# Altium schematic sheet I2S.SchDoc
size A4
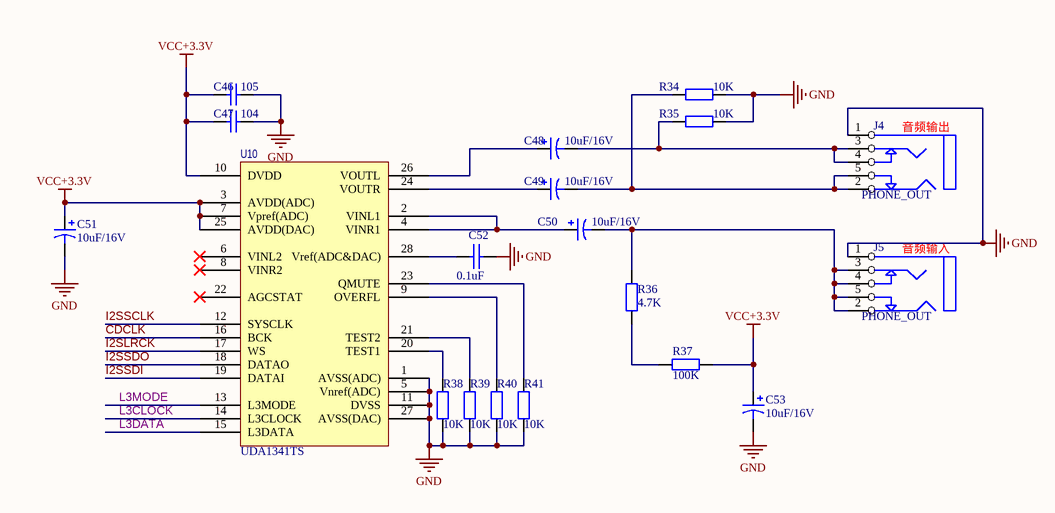
[diagram p0: I2S.SchDoc]

## Parts
C46  value 105  [0805]  (hidden comment: Cap)
C47  value 104  [0805]  (hidden comment: Cap)
C48  value 10uF/16V  [1206[3216]]  (hidden comment: Cap Pol2)
C49  value 10uF/16V  [1206[3216]]  (hidden comment: Cap Pol2)
C50  value 10uF/16V  [1206[3216]]  (hidden comment: Cap Pol2)
C51  value 10uF/16V  [1206[3216]]  (hidden comment: Cap Pol2)
C52  0.1uF  [0805]
C53  value 10uF/16V  [1206[3216]]  (hidden comment: Cap Pol2)
J4  PHONE_OUT  [PJ-215-B]
J5  PHONE_OUT  [PJ-215-B]
R34  value 10K  [0805]  (hidden comment: Res2)
R35  value 10K  [0805]  (hidden comment: Res2)
R36  value 4.7K  [0805]  (hidden comment: Res2)
R37  value 100K  [0805]  (hidden comment: Res2)
R38  value 10K  [0805]  (hidden comment: Res2)
R39  value 10K  [0805]  (hidden comment: Res2)
R40  value 10K  [0805]  (hidden comment: Res2)
R41  value 10K  [0805]  (hidden comment: Res2)
U10  UDA1341TS  [SOP_UDA1341TS_1]

## Nets
GND: C46.1 C47.1 C51.2 C52.2 C53.2 J4.1(A) J5.1(A) R34.2 R35.2 R38.1 R39.1 R40.1 R41.1 U10.1(AVSS(ADC)) U10.5(Vnref(ADC)) U10.11(DVSS) U10.27(AVSS(DAC))
VCC+3.3V: C46.2 C47.2 C51.1 C53.1 R37.1 U10.3(AVDD(ADC)) U10.7(Vpref(ADC)) U10.10(DVDD) U10.25(AVDD(DAC))
CDCLK: U10.16(BCK)
I2SLRCK: U10.17(WS)
I2SSCLK: U10.12(SYSCLK)
I2SSDI: U10.19(DATAI)
I2SSDO: U10.18(DATAO)
L3CLOCK: U10.14(L3CLOCK)
L3DATA: U10.15(L3DATA)
L3MODE: U10.13(L3MODE)
NetC48_1: C48.1 U10.26(VOUTL)
NetC48_2: C48.2 J4.3(C) J4.4(E) R35.1
NetC49_1: C49.1 U10.24(VOUTR)
NetC49_2: C49.2 J4.2(B) J4.5(F) R34.1
NetC50_1: C50.1 U10.2(VINL1) U10.4(VINR1)
NetC50_2: C50.2 J5.2(B) J5.3(C) J5.4(E) J5.5(F) R36.2
NetC52_1: C52.1 U10.28(Vref(ADC&DAC))
NetR36_1: R36.1 R37.2
NetR38_2: R38.2 U10.20(TEST1)
NetR39_2: R39.2 U10.21(TEST2)
NetR40_2: R40.2 U10.9(OVERFL)
NetR41_2: R41.2 U10.23(QMUTE)

Not connected (* = marked no-connect by the designer): U10 6(VINL2)* 8(VINR2)* 22(AGCSTAT)*

## Notes on the sheet
- (near J4) 音频输出
- (near J5) 音频输入

## Library data of the parts
C46 C47 = Cap: Capacitor; Published: 8-Jun-2000; LatestRevisionDate: 17-Jul-2002; LatestRevisionNote: Re-released for DXP Platform.; PackageReference: RAD-0.3; Publisher: Altium Limited
C48-C51 C53 = Cap Pol2: Polarized Capacitor (Axial); Published: 8-Jun-2000; LatestRevisionDate: 17-Jul-2002; LatestRevisionNote: Re-released for DXP Platform.; PackageReference: POLAR0.8; Publisher: Altium Limited
C52 = CAP: Capacitor; Value: 0.1uF
J4 J5 = PHONEJACK STEREO SW: Value: PHONE_OUT
R34-R41 = Res2: Resistor; Published: 8-Jun-2000; LatestRevisionDate: 17-Jul-2002; LatestRevisionNote: Re-released for DXP Platform.; PackageReference: AXIAL-0.4; Publisher: Altium Limited
U10 = UDA1341TS_1: Text Field1: 160; Text Field2: 170; Value: UDA1341TS